# Altium project NANORACK_EXT_LASER.PrjPcb
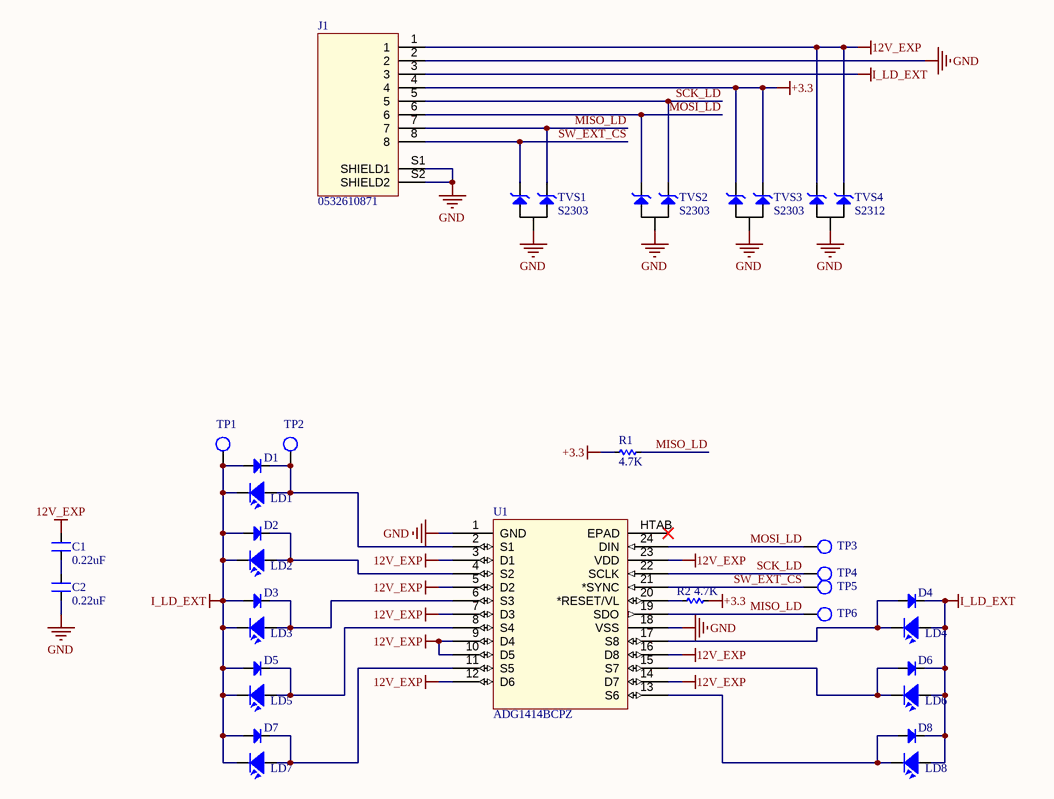
[diagram p0: EXT_LASER.SchDoc]
1 sheet, 32 parts. Net scope: global (net labels, ports and power ports of the same name join across sheets).

## Sheet EXT_LASER.SchDoc
size A3; SheetNumber: 1; SheetTotal: 1

### Parts
C1  0.22uF  [CN-SMD-0603]
C2  0.22uF  [CN-SMD-0603]
D1  Diode SMD  [DIO-SMD-123]  (value not drawn)
D2  Diode SMD  [DIO-SMD-123]  (value not drawn)
D3  Diode SMD  [DIO-SMD-123]  (value not drawn)
D4  Diode SMD  [DIO-SMD-123]  (value not drawn)
D5  Diode SMD  [DIO-SMD-123]  (value not drawn)
D6  Diode SMD  [DIO-SMD-123]  (value not drawn)
D7  Diode SMD  [DIO-SMD-123]  (value not drawn)
D8  Diode SMD  [DIO-SMD-123]  (value not drawn)
J1  0532610871  [0532610871]
LD1  LED  [LED-3MM-YELLOW]  (value not drawn)
LD2  LED  [LED-3MM-YELLOW]  (value not drawn)
LD3  LED  [LED-3MM-YELLOW]  (value not drawn)
LD4  LED  [LED-3MM-YELLOW]  (value not drawn)
LD5  LED  [LED-3MM-YELLOW]  (value not drawn)
LD6  LED  [LED-3MM-YELLOW]  (value not drawn)
LD7  LED  [LED-3MM-YELLOW]  (value not drawn)
LD8  LED  [LED-3MM-YELLOW]  (value not drawn)
R1  4.7K  [RES-SMD-0603]
R2  4.7K  [RES-SMD-0603]
TP1  Test-Point  [TESTPOINT]  (value not drawn)
TP2  Test-Point  [TESTPOINT]  (value not drawn)
TP3  Test-Point  [TESTPOINT]  (value not drawn)
TP4  Test-Point  [TESTPOINT]  (value not drawn)
TP5  Test-Point  [TESTPOINT]  (value not drawn)
TP6  Test-Point  [TESTPOINT]  (value not drawn)
TVS1  S2303  [SOT23-123]
TVS2  S2303  [SOT23-123]
TVS3  S2303  [SOT23-123]
TVS4  S2312  [SOT23-123]
U1  ADG1414BCPZ  [ADG1414BCPZ]

### Nets
12V_EXP: C1.2 J1.1 TVS4.1 TVS4.3 U1.3(D1) U1.5(D2) U1.7(D3) U1.9(D4) U1.10(D5) U1.12(D6) U1.14(D7) U1.16(D8) U1.23(VDD)
+3.3: J1.4 R1.1 R2.1 TVS3.1 TVS3.3
GND: C2.1 J1.2 J1.S1(SHIELD1) J1.S2(SHIELD2) TVS1.2 TVS2.2 TVS3.2 TVS4.2 U1.1(GND) U1.18(VSS)
I_LD_EXT: D1.1(A) D2.1(A) D3.1(A) D4.2(K) D5.1(A) D6.2(K) D7.1(A) D8.2(K) J1.3 LD1.2 LD2.2 LD3.2 LD4.1 LD5.2 LD6.1 LD7.2 LD8.1 TP1.1
MISO_LD: J1.7 R1.2 TP6.1 TVS1.1 U1.19(SDO)
MOSI_LD: J1.6 TP3.1 TVS2.3 U1.24(DIN)
SCK_LD: J1.5 TP4.1 TVS2.1 U1.22(SCLK)
SW_EXT_CS: J1.8 TP5.1 TVS1.3 U1.21(*SYNC)
NetC1_1: C1.1 C2.2
NetD1_2: D1.2(K) LD1.1 TP2.1 U1.2(S1)
NetD2_2: D2.2(K) LD2.1 U1.4(S2)
NetD3_2: D3.2(K) LD3.1 U1.6(S3)
NetD4_1: D4.1(A) LD4.2 U1.17(S8)
NetD5_2: D5.2(K) LD5.1 U1.8(S4)
NetD6_1: D6.1(A) LD6.2 U1.15(S7)
NetD7_2: D7.2(K) LD7.1 U1.11(S5)
NetD8_1: D8.1(A) LD8.2 U1.13(S6)
NetR2_2: R2.2 U1.20(*RESET/VL)

Not connected (* = marked no-connect by the designer): U1 HTAB(EPAD)*

### Notes on the sheet
- THIS DOCUMENT AND THE DATA DISCLOSED HEREIN OR
- HEREWITH IS THE PROPERTY OF ALTIUM LIMITED AND MAY
- DWG NO:
- REVISION
- REV:
- DESCRIPTION
- DATE
- APPROVED
- BE FREELY DISTRIBUTED IN WHOLE. NO RIGHTS ARE
- RESERVED OR EXPRESS OR IMPLIED WARANTEE GIVEN.
- ENG:
- APPROVALS
- PROJECT
- DSN:
- CHK:
- REFERENCE DOCUMENTS
- PROJECT REVISION:
- TITLE
- DOCUMENT REVISION:
- DESIGN ITEM:
- BOM:
- FAB DWG:
- PCB DWG:
- ASSY DWG:
- SCALE:
- A3
- SIZE
- CAGE CODE
- FILE NAME
- DWG NO.
- SHEET
- OF
- REV

### Library data of the parts
C1 C2 = CN: Value: 33pF
D1-D8 = Diode SMD: Default Diode; Code - JEDEC: DO-214-AB; Value: 1N5007; Published: 8-Jun-2000; Revision: July-2002: Re-released for DXP Platform.; Publisher: Altium Limited
J1 = Header8 - Shield: Header 8 + Shield
LD1-LD8 = LED: LED Single colour Green and Red; Value: LED 3 ly Single Colour
R1 R2 = Res-SMD: Resistor; Manufacturer: Generic Components; Class: Passive; Published: 08/06/2000; Publisher: Altium Hobart Technology Centre
TVS1-TVS3 = S2303: TVS DIODE 3.3VWM 8VC SOT23, P/N: / S2303
TVS4 = S2315: TVS DIODE 12VWM 19VC SOT233
U1 = ADG1414BCPZ: IC SW SPST-NOX8 11.5OHM 24LFCSP